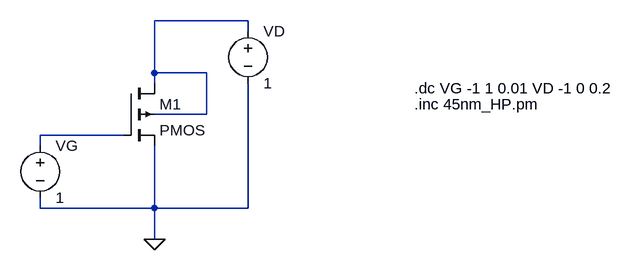
[diagram p0: schematic 45p_IDVD.asc]
45p_IDVD.asc, the LTspice schematic file:
Version 4
SHEET 1 900 680
WIRE 320 32 176 32
WIRE 320 48 320 32
WIRE 176 112 176 32
WIRE 256 112 176 112
WIRE 176 128 176 112
WIRE 256 176 256 112
WIRE 256 176 176 176
WIRE 128 208 0 208
WIRE 0 224 0 208
WIRE 0 320 0 304
WIRE 176 320 176 224
WIRE 176 320 0 320
WIRE 320 320 320 128
WIRE 320 320 176 320
WIRE 176 368 176 320
FLAG 176 368 0
SYMBOL pmos4 128 128 R0
SYMATTR InstName M1
SYMATTR Value2 l=45n w=90n
SYMBOL voltage 0 208 R0
SYMATTR InstName VG
SYMATTR Value 1
SYMBOL voltage 320 32 R0
SYMATTR InstName VD
SYMATTR Value 1
TEXT 576 160 Left 2 !.inc 45nm_HP.pm
TEXT 576 136 Left 2 !.dc VG -1 1 0.01 VD -1 0 0.2

The netlist it stands for:
* 45p_IDVD.asc
M1 N001 N002 0 N001 PMOS l=45n w=90n
VG N002 0 1
VD N001 0 1
.model NMOS NMOS
.model PMOS PMOS
.lib standard.mos
.inc 45nm_HP.pm
.dc VG -1 1 0.01 VD -1 0 0.2
.backanno
.end